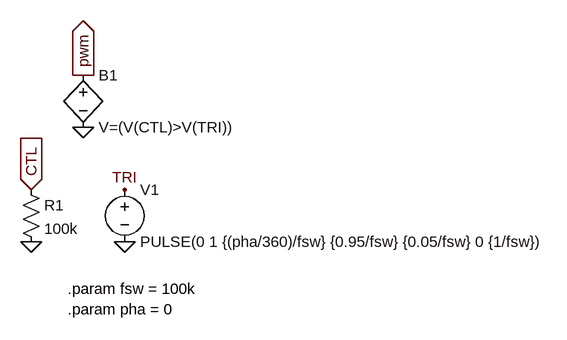
[diagram p0: schematic pwm.asc]
pwm.asc, the LTspice schematic file:
Version 4
SHEET 1 880 680
FLAG 64 -80 0
FLAG 64 -160 TRI
FLAG -80 -80 0
FLAG -80 -160 CTL
IOPIN -80 -160 In
FLAG 0 -256 0
FLAG 0 -336 pwm
IOPIN 0 -336 Out
SYMBOL voltage 64 -176 R0
WINDOW 123 0 0 Left 0
WINDOW 39 0 0 Left 0
SYMATTR InstName V1
SYMATTR Value PULSE(0 1 {(pha/360)/fsw} {0.95/fsw} {0.05/fsw} 0 {1/fsw})
SYMBOL bv 0 -352 R0
SYMATTR InstName B1
SYMATTR Value V=(V(CTL)>V(TRI))
SYMBOL res -96 -176 R0
SYMATTR InstName R1
SYMATTR Value 100k
TEXT -24 -8 Left 2 !.param fsw = 100k
TEXT -24 24 Left 2 !.param pha = 0

The netlist it stands for:
* pwm.asc
V1 TRI 0 PULSE(0 1 {(pha/360)/fsw} {0.95/fsw} {0.05/fsw} 0 {1/fsw})
B1 pwm 0 V=(V(CTL)>V(TRI))
R1 CTL 0 100k
.param fsw = 100k
.param pha = 0
.backanno
.end